# Altium schematic sheet MRX80SQUARE.SchDoc
size A4
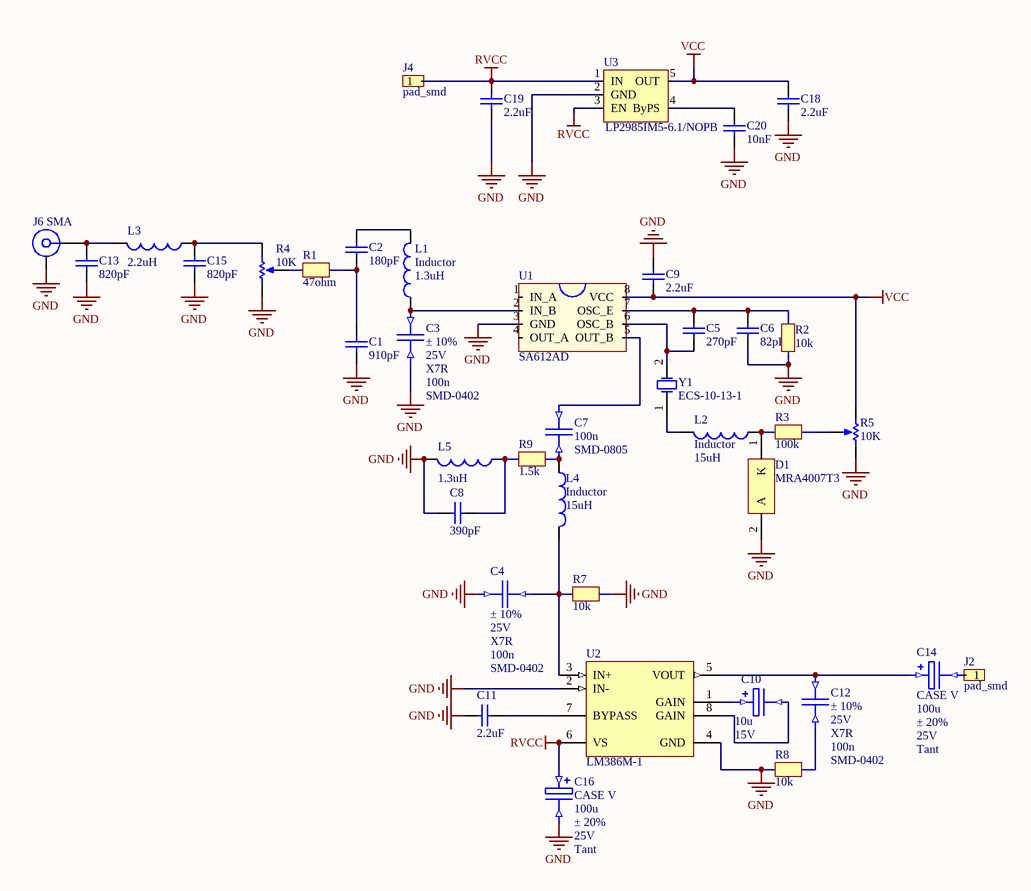
[diagram p0: MRX80SQUARE.SchDoc]

## Parts
C1  value 910pF  [0402]  (hidden comment: Cap Semi)
C2  value 180pF  [0402]  (hidden comment: Cap Semi)
C3  value 100n  Tolerance: ± 10%  Voltage: 25V  Type: X7R  PackageReference: SMD-0402  [CAPC1005X04N_0402]  (hidden comment: Capacitor)
C4  value 100n  Tolerance: ± 10%  Voltage: 25V  Type: X7R  PackageReference: SMD-0402  [CAPC1005X04N_0402]  (hidden comment: Capacitor)
C5  value 270pF  [0402]  (hidden comment: Cap Semi)
C6  value 82pF  [0402]  (hidden comment: Cap Semi)
C7  value 100n  PackageReference: SMD-0805  [CAPC2012X06N_0806]  (hidden comment: Capacitor)
C8  value 390pF  [0402]  (hidden comment: Cap Semi)
C9  value 2.2uF  [0402]  (hidden comment: Cap Semi)
C10  value 10u  Voltage: 15V  [CAP_CASE_B_1210_m3225]  (hidden comment: Capacitor)
C11  value 2.2uF  [0402]  (hidden comment: Cap Semi)
C12  value 100n  Tolerance: ± 10%  Voltage: 25V  Type: X7R  PackageReference: SMD-0402  [CAPC1005X04N_0402]  (hidden comment: Capacitor)
C13  value 820pF  [0402]  (hidden comment: Cap Semi)
C14  value 100u  PackageDescription: CASE V  Tolerance: ± 20%  Voltage: 25V  Type: Tant  [CAP_CASE_V_2924_m7361-38]  (hidden comment: Capacitor)
C15  value 820pF  [0402]  (hidden comment: Cap Semi)
C16  value 100u  PackageDescription: CASE V  Tolerance: ± 20%  Voltage: 25V  Type: Tant  [CAP_CASE_V_2924_m7361-38]  (hidden comment: Capacitor)
C18  value 2.2uF  [0402]  (hidden comment: Cap Semi)
C19  value 2.2uF  [0402]  (hidden comment: Cap Semi)
C20  value 10nF  [0402]  (hidden comment: Cap Semi)
D1  MRA4007T3  [ONSC-SMA-2-403D-02_V]
J2  pad_smd  [pad_smd_bodge]
J4  pad_smd  [pad_smd_bodge]
J6  SMA  [ROS-32K145-400L5_V]
L1  Inductor  value 1.3uH  [0402-A]
L2  Inductor  value 15uH  [0402-A]
L3  value 2.2uH  [0603]  (hidden comment: Inductor)
L4  Inductor  value 15uH  [0402-A]
L5  value 1.3uH  [0402-A]  (hidden comment: Inductor)
R1  value 47ohm  [RESC1005X04N_0402]  (hidden comment: Resistor)
R2  value 10k  [RESC1005X04N_0402]  (hidden comment: Resistor)
R3  value 100k  [RESC1005X04N_0402]  (hidden comment: Resistor)
R4  value 10K  [VR5]  (hidden comment: RPot)
R5  value 10K  [VR5]  (hidden comment: RPot)
R7  value 10k  [RESC1005X04N_0402]  (hidden comment: Resistor)
R8  value 10k  [RESC1005X04N_0402]  (hidden comment: Resistor)
R9  value 1.5k  [RESC1608X06N_0603]  (hidden comment: Resistor)
U1  SA612AD  [SO8_SOIC8]
U2  LM386M-1  [M08A_N]
U3  LP2985IM5-6.1/NOPB  [SOT23-5]
Y1  ECS-10-13-1  [HC-49U]

## Nets
GND: C1.1 C3.1 C4.2 C6.1 C8.2 C9.2 C11.2 C13.1 C15.1 C16.2 C18.1 C19.1 C20.1 D1.2(A) J6.MP L5.2 R2.1 R4.1(TOP) R5.2(BOT) R7.1 R8.1 U1.3(GND) U2.2(IN-) U2.4(GND) U3.2(GND)
RVCC: C16.1 C19.2 J4.1 U2.6(VS) U3.1(IN) U3.3(EN)
VCC: C9.1 C18.2 R5.1(TOP) U1.8(VCC) U3.5(OUT)
NetC1_2: C1.2 C2.1 R1.2
NetC2_2: C2.2 L1.2
NetC3_2: C3.2 L1.1 U1.2(IN_B)
NetC4_1: C4.1 L4.2 R7.2 U2.3(IN+)
NetC5_1: C5.1 U1.6(OSC_B) Y1.2(OSC2)
NetC5_2: C5.2 C6.2 R2.2 U1.7(OSC_E)
NetC7_1: C7.1 L4.1 R9.2
NetC7_2: C7.2 U1.5(OUT_B)
NetC8_1: C8.1 L5.1 R9.1
NetC10_1: C10.1 U2.1(GAIN)
NetC10_2: C10.2 U2.8(GAIN)
NetC11_1: C11.1 U2.7(BYPASS)
NetC12_1: C12.1 R8.2
NetC12_2: C12.2 C14.1 U2.5(VOUT)
NetC13_2: C13.2 J6.1 L3.2
NetC14_2: C14.2 J2.1
NetC15_2: C15.2 L3.1 R4.2(BOT)
NetC20_2: C20.2 U3.4(ByPS)
NetD1_1: D1.1(K) L2.1 R3.1
NetL2_2: L2.2 Y1.1(OSC1)
NetR1_1: R1.1 R4.3(TAP)
NetR3_2: R3.2 R5.3(TAP)

Not connected (* = marked no-connect by the designer): U1 1(IN_A) 4(OUT_A)

## Library data of the parts
C1 C2 C5 C6 C8 C9 C11 C13 C15 C18-C20 = Cap Semi: Capacitor (Semiconductor SIM Model); Published: 8-Jun-2000; LatestRevisionDate: 29-May-2009; LatestRevisionNote: IPC-7351 Footprint Added.; PackageReference: C1206; Publisher: Altium Limited; PackageDescription: Chip Capacitor
C3 C4 C12 = Capacitor_100n_0402_Bulk: Class 1 SMD Capacitor; ManufacturerRef: MC0402B104K250CT; Manufacturer: MULTICOMP; PowerRating: N.A.; OrderCode: 2310482; Seller: Farnell; TemperatureCoeff: ± 15%; PackageDescription: SMD; Published: 9.5.2014; Publisher: atr; PriceEuro: 0.0055
C7 = Capacitor_47n_0805_C0G: Class 1 SMD Capacitor; ManufacturerRef: C0805C473J3GACTU; Manufacturer: Kemet; PowerRating: N.A.; OrderCode: 1535570RL; Seller: Farnell; TemperatureCoeff: 0ppm/°C ± 30ppm/°C; Tolerance: ± 5%; Voltage: 25V; Type: C0G / NP0; PackageDescription: SMD; Published: 9.5.2014; Publisher: atr; PriceEuro: 0.28
C10 = Capacitor_100u_Tant_SMD_CASE_B_m3525: Tant SMD Capacitor; ManufacturerRef: TPSB107M010R0400; Manufacturer: AVX; PowerRating: N.A.; OrderCode: 1658510RL; Seller: Farnell; ESR: 0.4Ohm; TemperatureRange: -55°C to +125°C; Tolerance: ± 20%; PriceEuro: 0.89; Published: 15.5.2014; Publisher: atr; TemperatureCoeff: -; PackageReference: SMD-1210 [3225 Metric]; PackageDescription: CASE B; Type: Tant
C14 C16 = Capacitor_100u_Tant_SMD_CASE_V_m7361: Tant SMD Capacitor; ManufacturerRef: TPSV107K025R0100; Manufacturer: AVX; PowerRating: N.A.; OrderCode: 1659002; Seller: Farnell; ESR: 0.1Ohm; TemperatureRange: -55°C to +125°C; LatestRevisionDate: 3.9.2014; LatestRevisionNote: 3.9.2014; PriceEuro: 4.94; Published: 3.9.2014; Publisher: atr; TemperatureCoeff: -; PackageReference: SMD-2924 [7361 Metric]
D1 = MRA4007T3: Surface Mount Standard Recovery Power Rectifier, 2-Pin SMA, Tape and Reel; Manufacturer: On Semiconductor; IFSM Max (A): 30; IO(rec) Max (A): 1; VRRM Max (V): 1000; DatasheetVersion: Rev. 9; PackageVersion: Rev. G, 07/2012; PackageReference: SMA-2-403D-02; PackageDescription: 2-Pin Small Molded Package, J-Bend Lead, Body 2.605 x 4.315 mm; Supplier 1: Digi-Key; Supplier Part Number 1: MRA4007T3OSTR-ND; Supplier 2: Digi-Key; Supplier Part Number 2: MRA4007T3OSCT-ND; Supplier 3: Digi-Key; Supplier Part Number 3: MRA4007T3OSDKR-ND; Packing: Tape and Reel; RoHS: FALSE; Type: Standard Recovery; Mounting Technology: Surface Mount; PartNumber: MRA4007T3; ComponentLink1Description: Manufacturer URL; ComponentLink1URL: http://www.onsemi.com/; ComponentLink2Description: Datasheet; ComponentLink2URL: http://www.onsemi.com/pub_link/Collateral/MRA4003T3-D.PDF; ComponentLink3Description: Package Specification; ComponentLink3URL: http://www.onsemi.com/pub_link/Collateral/403D-02.PDF
J2 J4 = pad_smd_1mm*2mm: 1mm * 2mm smd pad
J6 = 32K145-400L5: SMA Right Angle Jack, Edge Mount, Up to 18 GHz, -55 to 155 degC; Design Note 1: Footprint in library is a generic example - only application specific footprint delivers High Performance; Desgin Note 2: For more information about DRC setting, please look at following webpage, http://techdocs.altium.com/display/SCRT/Design+Rule+for+Edge-Mount+Connectors; DatasheetVersion: b00; PackageVersion: b00; PackageReference: 32K145-400L5; PackageDescription: SMA Right Angle Jack, Edge Mount, 14.25 x 9.5 x 4.46 mm; Mounting Technology: Surface Mount; PartNumber: 32K145-400L5; ComponentLink1Description: Manufacturer URL; ComponentLink1URL: http://www.rosenberger.de; ComponentLink2Description: Datasheet; ComponentLink2URL: http://rosenberger.de/ok/images/documents/db/32K145-400L5.pdf; ComponentLink3Description: Package Specification; ComponentLink3URL: http://rosenberger.de/ok/images/documents/db/32K145-400L5.pdf; ComponentLink4Description: Series Overview / Design Note; ComponentLink4URL: http://rosenberger.de/ok/images/documents/spez/32.pdf; ComponentLink5Description: Webshop / RFQ; ComponentLink5URL: http://www.rosenberger.com/en/contact/sales/
L1-L5 = Inductor: Code_IEC: 1005; Published: 8-Jun-2000; LatestRevisionDate: 29-May-2009; LatestRevisionNote: IPC-7351 Footprint Added.; PackageReference: 0402-A; Publisher: Altium Limited; PackageDescription: Chip Inductor; Code_JEITA: 0402
R1-R3 R7-R9 = Resistor_SMD_Generic: Generic SMD Resistor; Manufacturer: SUSUMU; ManufacturerRef: RR0816P-104-B-T5; Seller: Farnell; Voltage: 75V; PowerRating: 63mW; OrderCode: 1653254RL; Tolerance: ± 0.1%; TemperatureCoeff: ± 25ppm/°C; Type: Thin Film; PriceEuro: 0.085; PackageDescription: SMD; Publisher: atr; PackageReference: SMD-0603
R4 R5 = RPot: Potentiometer; Sim Note: Enter the Resistance value and the set point into parameter fields.; Set Position: 0.5; Published: 8-Jun-2000; LatestRevisionDate: 17-Jul-2002; LatestRevisionNote: Re-released for DXP Platform.; PackageReference: VR5; Publisher: Altium Limited; PackageDescription: Variable Resistor, Thru-Hole; 3 Leads
U1 = SA612AD: Manufacturer 1: NXP Semiconductors; Manufacturer Part Number 1: SA612AD/01,118; Input Frequency: 500MHz; Power Gain: 17dB; Supplier 1: Mouser; Stock 1: 1993; Pricing 1: 1=2.34, 10=1.92, 50=1.92, 100=1.54, 1000=1.11, 10000=0.998 (USD); Operating Temperature (Min): -40C; Operating Temperature (Max): 85C; Package Type: SO; Packaging: Tape and Reel; Operating Temperature Classification: Industrial; ComponentLink1URL: https://datasheet.ciiva.com/27052/1460068-27052253.pdf; ComponentLink1Description: https://datasheet.ciiva.com/27052/1460068-27052253.pdf; ComponentLink2URL: https://datasheet.ciiva.com/15100/getdatasheetpartid-117259-15100947.pdf; ComponentLink2Description: https://datasheet.ciiva.com/15100/getdatasheetpartid-117259-15100947.pdf; ComponentLink3URL: https://datasheet.ciiva.com/3271/sa612a-3271368.pdf; ComponentLink3Description: https://datasheet.ciiva.com/3271/sa612a-3271368.pdf; Supplier Part Number 1: SA612AD
U2 = LM386M-1: Low Voltage Audio Power Amplifier, 8-pin Narrow SOIC; Manufacturer: National Semiconductor; PackageTopMarking: NSZXTT*LM386*M-1; PowerWise: N; CompType: Audio IC; High-Reliability: Y; DatasheetVersion: Aug-2000; PackageVersion: revM, May-2009; PackageReference: M08A; PackageDescription: SOIC Narrow, 4.9 x 3.9 x 1.45mm, 8 Lead, 1.27mm Pitch; PartNumber: LM386M-1; RoHS: N; PinCount: 8; Code_JEDEC: MS-012-AA; Code_IPC: SOIC127P600-8; ComponentLink1Description: Manufacturer URL; ComponentLink1URL: http://www.national.com/; ComponentLink2Description: LM386 Datasheet; ComponentLink2URL: http://www.national.com/ds/LM/LM386.pdf; ComponentLink3Description: LM386 Web Page; ComponentLink3URL: http://www.national.com/pf/LM/LM386.html; ComponentLink4Description: M08A Package Page; ComponentLink4URL: http://www.national.com/packaging/folders/m08a.html
U3 = LP2985IM5-6.1/NOPB: 6.1V 150mA LDO; Manufacturer 1: Texas Instruments; Rad Hard: No; Polarity: Positive; Number of Outputs: 1; Minimum Input Voltage: 2.5 V; Maximum Input Voltage: 16 V; Maximum Output Current: 0.15 A; Typical Dropout Voltage @ Current: 0.0001@0mA|0.007@1mA|0.04@10mA|0.12@50mA|0.28@150mA V; Accuracy: ±3 %; Line Regulation: 0.014 %/V; Output Type: Fixed; Supplier 1: Mouser; Stock 1: 539; Pricing 1: 1=0.76, 10=0.632, 50=0.632, 100=0.408, 1000=0.326, 10000=0.265 (USD); Packaging: Tape & Reel; Package: 5SOT-23; Type: Linear; Output Voltage: 6.1 V; Operating Temperature: -40 to 125 °C; Mounting: Surface Mount; Category: Linear Regulator; ComponentLink1URL: https://datasheet.ciiva.com/6592/lp2985-n-6592025.pdf; ComponentLink1Description: https://datasheet.ciiva.com/6592/lp2985-n-6592025.pdf; ComponentLink2URL: https://datasheet.ciiva.com/26168/lp2985-n-26168191.pdf; ComponentLink2Description: https://datasheet.ciiva.com/26168/lp2985-n-26168191.pdf; ComponentLink3URL: https://datasheet.ciiva.com/6592/lp2985-n-6592022.pdf; ComponentLink3Description: https://datasheet.ciiva.com/6592/lp2985-n-6592022.pdf; ComponentLink4URL: https://datasheet.ciiva.com/13028/lp2985-n-13028680.pdf; ComponentLink4Description: https://datasheet.ciiva.com/13028/lp2985-n-13028680.pdf; Supplier Part Number 1: 926-LP2985IM561NOPB; Manufacturer Part Number 1: LP2985IM5-6.1/NOPB
Y1 = ECS-10-13-1: Crystal Oscillator; Published: 17-Jul-2002; DatasheetDocument: 18-Apr-2000; PackageReference: HC-49U; Publisher: Altium Limited; ComponentLink1Description: Manufacturer Link; ComponentLink1URL: http://www.ecsxtal.com/; ComponentLink2Description: Datasheet; ComponentLink2URL: http://www.ecsxtal.com/pdf2/HC49U.PDF